# Altium schematic sheet Dogfish3D - Thermistor Channel.SchDoc
size A
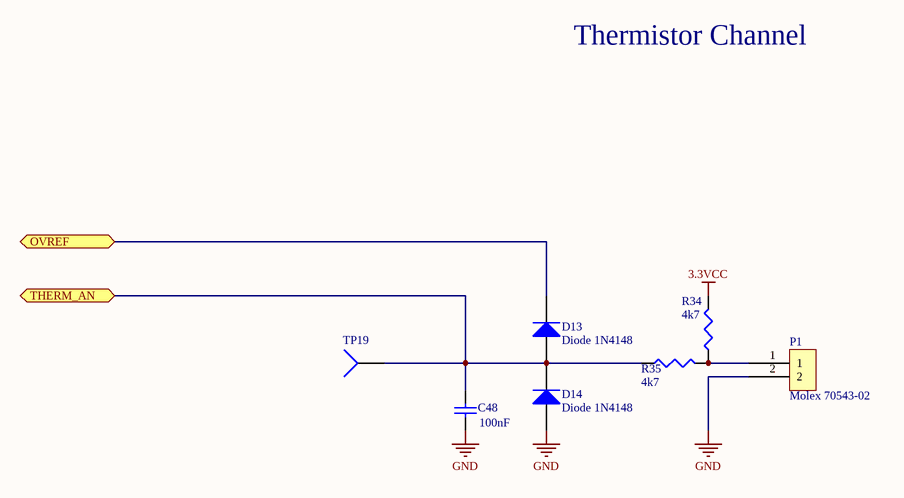
[diagram p0: Dogfish3D - Thermistor Channel.SchDoc]

## Parts
C48  value 100nF  [1608[0603]]  (hidden comment: Cap Semi)
D13  Diode 1N4148  [1N4148WT]
D14  Diode 1N4148  [1N4148WT]
P1  Molex 70543-02  [70543-02]
R34  value 4k7  [J1-0603]  (hidden comment: Res3)
R35  value 4k7  [J1-0603]  (hidden comment: Res3)
TP19  TP4  [TP-2]  (value not drawn)

## Ports
OVREF, THERM_AN

## Nets
3.3VCC: R34.2
GND: C48.1 D14.1(A) P1.2
OVREF: D13.2(K) ; port OVREF
THERM_AN: C48.2 D13.1(A) D14.2(K) R35.1 TP19.1 ; port THERM_AN
NetP1_1: P1.1 R34.1 R35.2

## Notes on the sheet
- Thermistor Channel

## Library data of the parts
C48 = Cap Semi: Capacitor (Semiconductor SIM Model); Published: 8-Jun-2000; LatestRevisionDate: 29-May-2009; LatestRevisionNote: IPC-7351 Footprint Added.; PackageReference: C1206; Publisher: Altium Limited; PackageDescription: Chip Capacitor
D13 D14 = Diode 1N4148: High Conductance Fast Diode; Published: 8-Jun-2000; LatestRevisionDate: 17-Jul-2002; LatestRevisionNote: Re-released for DXP Platform.; DatasheetVersion: 1997; PackageReference: DO-35; Publisher: Altium Limited; PackageDescription: Diode, Axial; Body 3.8 x 1.9 mm (LxDia. max), Lead Dia. 0.53 mm (max); Code_JEDEC: DO-204-AH; ComponentLink1Description: Manufacturer Link; ComponentLink1URL: http://www.fairchildsemi.com/; ComponentLink2Description: Datasheet; ComponentLink2URL: http://www.fairchildsemi.com/ds/1N%2F1N4148.pdf
R34 R35 = Res3: Resistor; Published: 8-Jun-2000; LatestRevisionDate: 29-May-2009; LatestRevisionNote: IPC-7351 Footprint Added.; PackageReference: J1-0603; Publisher: Altium Limited; PackageDescription: Chip Resistor
TP19 = Socket: LatestRevisionDate: 17-Jul-2002; LatestRevisionNote: Re-released for DXP Platform.; Publisher: Altium Limited